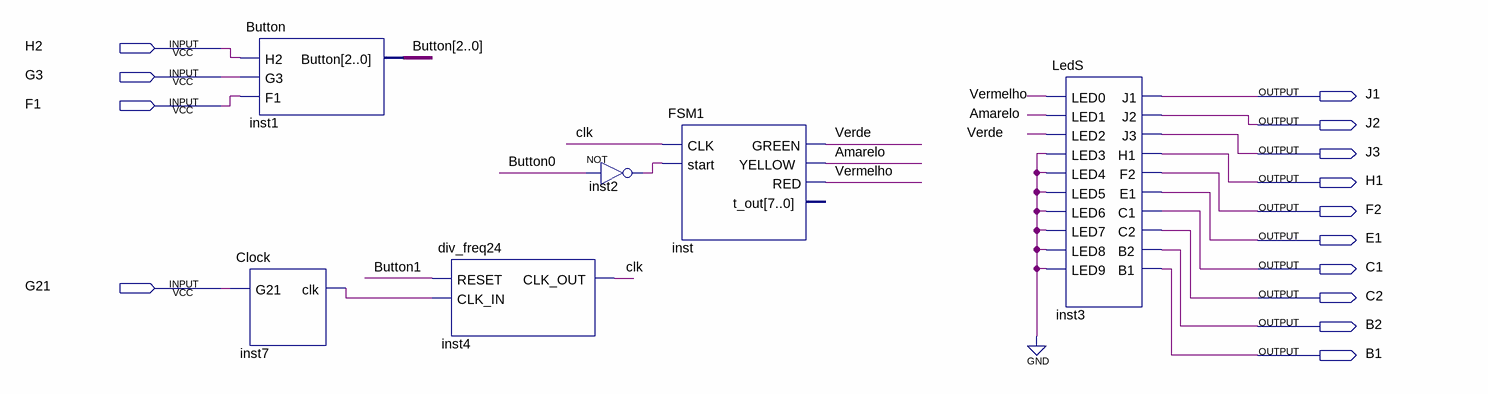
[diagram p0: schematic sheet]
// Quartus schematic Semaforo_TL.bdf as structural Verilog: 6 symbols, 14 pins
module Semaforo_TL (
  input  H2,
  input  G3,
  input  F1,
  input  G21,
  output J1,
  output J2,
  output J3,
  output H1,
  output F2,
  output E1,
  output C1,
  output C2,
  output B2,
  output B1
);

  wire Amarelo, clk, inst2_out, inst7_clk, Verde, Vermelho;
  wire [2:0] Button;

  Clock inst7 (.G21(G21), .clk(inst7_clk));
  Button inst1 (.H2(H2), .G3(G3), .F1(F1), .Button(Button));
  div_freq24 inst4 (.RESET(Button[1]), .CLK_IN(inst7_clk), .CLK_OUT(clk));
  not inst2 (inst2_out, Button[0]);
  FSM1 inst (.CLK(clk), .start(inst2_out), .GREEN(Verde), .YELLOW(Amarelo), .RED(Vermelho));  // open: t_out
  LedS inst3 (
    .LED0(Vermelho), .LED1(Amarelo), .LED2(Verde), .LED3(1'b0), .LED4(1'b0), .LED5(1'b0), .LED6(1'b0),
    .LED7(1'b0), .LED8(1'b0), .LED9(1'b0), .J1(J1), .J2(J2), .J3(J3), .H1(H1), .F2(F2), .E1(E1), .C1(C1),
    .C2(C2), .B2(B2), .B1(B1));
endmodule
